# Altium schematic sheet obc-v2_BOARD-CONNECT.SchDoc
size 420 x 297 mm; SheetNumber: 9; SheetTotal: 23
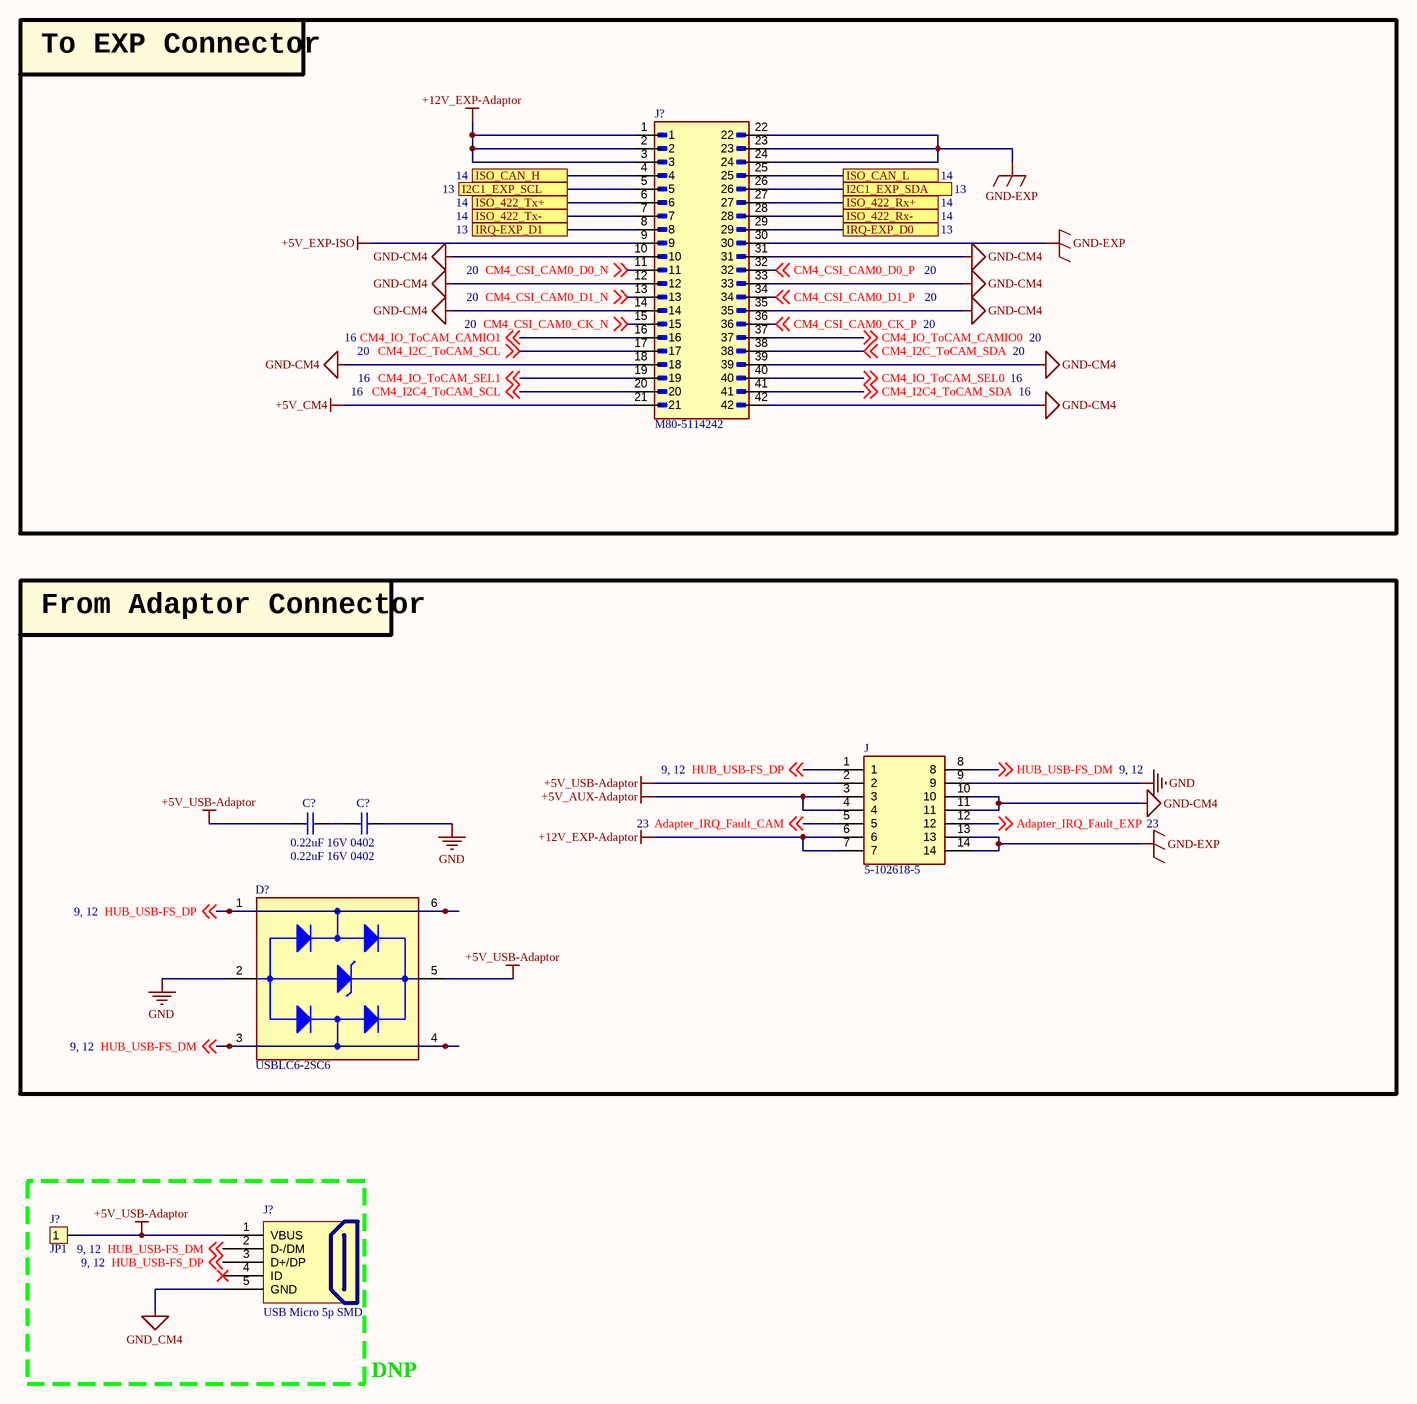
[diagram p0: obc-v2_BOARD-CONNECT.SchDoc]

## Parts
(Parts that share a designator on the sheet are numbered #1, #2 ... from top to bottom, then left to right.)
C?#1  0.22uF 16V 0402  [tu 0402]
C?#2  0.22uF 16V 0402  [tu 0402]
D?  USBLC6-2SC6  [SOT95P280X145-6N]
J  5-102618-5  [TE_5-102618-5]
J?#1  M80-5114242  [HARWIN_M80-5114242]
J?#2  JP1  [JP1-D1T]
J?#3  USB Micro 5p SMD  [USB Micro 5p SMD]

## Blocks framed on the sheet
To EXP Connector: J?#1
From Adaptor Connector: C?#1 C?#2 D? J

## Ports
I2C1_EXP_SCL (see 13), I2C1_EXP_SDA (see 13), IRQ-EXP_D0 (see 13), IRQ-EXP_D1 (see 13), ISO_422_Rx+ (see 14), ISO_422_Rx- (see 14), ISO_422_Tx+ (see 14), ISO_422_Tx- (see 14), ISO_CAN_H (see 14), ISO_CAN_L (see 14)

## Nets
+5V_AUX-Adaptor: J.3 J.4
+5V_CM4: J?#1.21
+5V_EXP-ISO: J?#1.9
+5V_USB-Adaptor: C?#1.2 D?.5(VBUS) J.2 J?#2.1 J?#3.1(VBUS)
+12V_EXP-Adaptor: J.6 J.7 J?#1.1 J?#1.2 J?#1.3
GND: C?#2.1 D?.2(GND) J.9
GND-CM4: J.10 J.11 J?#1.10 J?#1.12 J?#1.14 J?#1.18 J?#1.31 J?#1.33 J?#1.35 J?#1.39 J?#1.42
GND-EXP: J.13 J.14 J?#1.22 J?#1.23 J?#1.24 J?#1.30
GND_CM4: J?#3.5(GND)
Adapter_IRQ_Fault_CAM: J.5 ; off-sheet Adapter_IRQ_Fault_CAM
Adapter_IRQ_Fault_EXP: J.12 ; off-sheet Adapter_IRQ_Fault_EXP
CM4_CSI_CAM0_CK_N: J?#1.15 ; off-sheet CM4_CSI_CAM0_CK_N
CM4_CSI_CAM0_CK_P: J?#1.36 ; off-sheet CM4_CSI_CAM0_CK_P
CM4_CSI_CAM0_D0_N: J?#1.11 ; off-sheet CM4_CSI_CAM0_D0_N
CM4_CSI_CAM0_D0_P: J?#1.32 ; off-sheet CM4_CSI_CAM0_D0_P
CM4_CSI_CAM0_D1_N: J?#1.13 ; off-sheet CM4_CSI_CAM0_D1_N
CM4_CSI_CAM0_D1_P: J?#1.34 ; off-sheet CM4_CSI_CAM0_D1_P
CM4_I2C4_ToCAM_SCL: J?#1.20 ; off-sheet CM4_I2C4_ToCAM_SCL
CM4_I2C4_ToCAM_SDA: J?#1.41 ; off-sheet CM4_I2C4_ToCAM_SDA
CM4_I2C_ToCAM_SCL: J?#1.17 ; off-sheet CM4_I2C_ToCAM_SCL
CM4_I2C_ToCAM_SDA: J?#1.38 ; off-sheet CM4_I2C_ToCAM_SDA
CM4_IO_ToCAM_CAMIO0: J?#1.37 ; off-sheet CM4_IO_ToCAM_CAMIO0
CM4_IO_ToCAM_CAMIO1: J?#1.16 ; off-sheet CM4_IO_ToCAM_CAMIO1
CM4_IO_ToCAM_SEL0: J?#1.40 ; off-sheet CM4_IO_ToCAM_SEL0
CM4_IO_ToCAM_SEL1: J?#1.19 ; off-sheet CM4_IO_ToCAM_SEL1
HUB_USB-FS_DM: D?.3(I/O2_IN) D?.4(I/O2_OUT) J.8 J?#3.2(D-/DM) ; off-sheet HUB_USB-FS_DM
HUB_USB-FS_DP: D?.1(I/O1_IN) D?.6(I/O1_OUT) J.1 J?#3.3(D+/DP) ; off-sheet HUB_USB-FS_DP
I2C1_EXP_SCL: J?#1.5 ; port I2C1_EXP_SCL
I2C1_EXP_SDA: J?#1.26 ; port I2C1_EXP_SDA
IRQ-EXP_D0: J?#1.29 ; port IRQ-EXP_D0
IRQ-EXP_D1: J?#1.8 ; port IRQ-EXP_D1
ISO_422_Rx+: J?#1.27 ; port ISO_422_Rx+
ISO_422_Rx-: J?#1.28 ; port ISO_422_Rx-
ISO_422_Tx+: J?#1.6 ; port ISO_422_Tx+
ISO_422_Tx-: J?#1.7 ; port ISO_422_Tx-
ISO_CAN_H: J?#1.4 ; port ISO_CAN_H
ISO_CAN_L: J?#1.25 ; port ISO_CAN_L
NetC?#1_1: C?#1.1 C?#2.2

Not connected (* = marked no-connect by the designer): J?#3 4(ID)*

## Notes on the sheet
- DNP
- Project:
- Sub-system:
- Design by:
- Sheet title:
- Sheet
- A3
- of
- Checked by:
- Approved by:
- Revision:
- Document No:
- Size:
- Date:

## Library data of the parts
C?#1 C?#2 = Tu 0402 33nF 10V: 0.22 µF ±10% 16V Ceramic Capacitor X7R 0402 (1005 Metric): GCM155R71C224KE02D; Chung_Loai: Dán; Don_Vi: Con; So_Chan: 2; Ten_Linh_Kien: Tụ 0402 33nF X7R 10V GRM155R71A333KA01D; Ma_Hang: MH007853; Kieu_Chan: *
D? = USBLC6-2SC6: 17V Clamp 5A (8/20Âµs) Ipp Tvs Diode Surface Mount SOT-23-6; MF: STMicroelectronics; Value: *; SnapEDA_Link: https://www.snapeda.com/parts/USBLC6-2SC6/STMicroelectronics/view-part/?ref=snap; Check_prices: https://www.snapeda.com/parts/USBLC6-2SC6/STMicroelectronics/view-part/?ref=eda; Purchase-URL: https://pricing.snapeda.com/search/part/USBLC6-2SC6/?ref=eda; Price: None; Availability: In Stock; Package: SOT-23-6 STMicroelectronics; MP: USBLC6-2SC6
J = 5-102618-5: Conn Shrouded Header HDR 14 POS 2.54mm Solder ST Thru-Hole Tray; MF: TE Connectivity; Value: *; Availability: Unavailable; Package: None; Price: None; SnapEDA_Link: https://www.snapeda.com/parts/5-102618-5/TE%20Connectivity%20AMP%20Connectors/view-part/367931/?ref=snap; MP: 5-102618-5
J?#2 = JP1: WR-PHD 2.54 mm Angled Socket Header; Manufacturer: W¨¹rth Elektronik eiSos GmbH; partNo: 613002143121; ComponentLink1 Description: Manufacturer; ComponentLink2 Description: Datasheet; NoPins: 02; Created Date: 29 March 2013; ComponentLink1URL: http://www.we-online.com; ComponentLink2URL: http://katalog.we-online.de/em/datasheet/6130xx143121.pdf; Created by: Karrer Zheng
J?#3 = USB Micro 5p SMD: USB Type B; Ten: MicroUSB MK5P SMD; Ma_Hang: MH001020
J?#1 = M80-5114242: Package: None; Price: None; Value: *; MP: M80-5114242; Availability: Unavailable